# Altium schematic sheet BatteryMonitor.SchDoc
size A
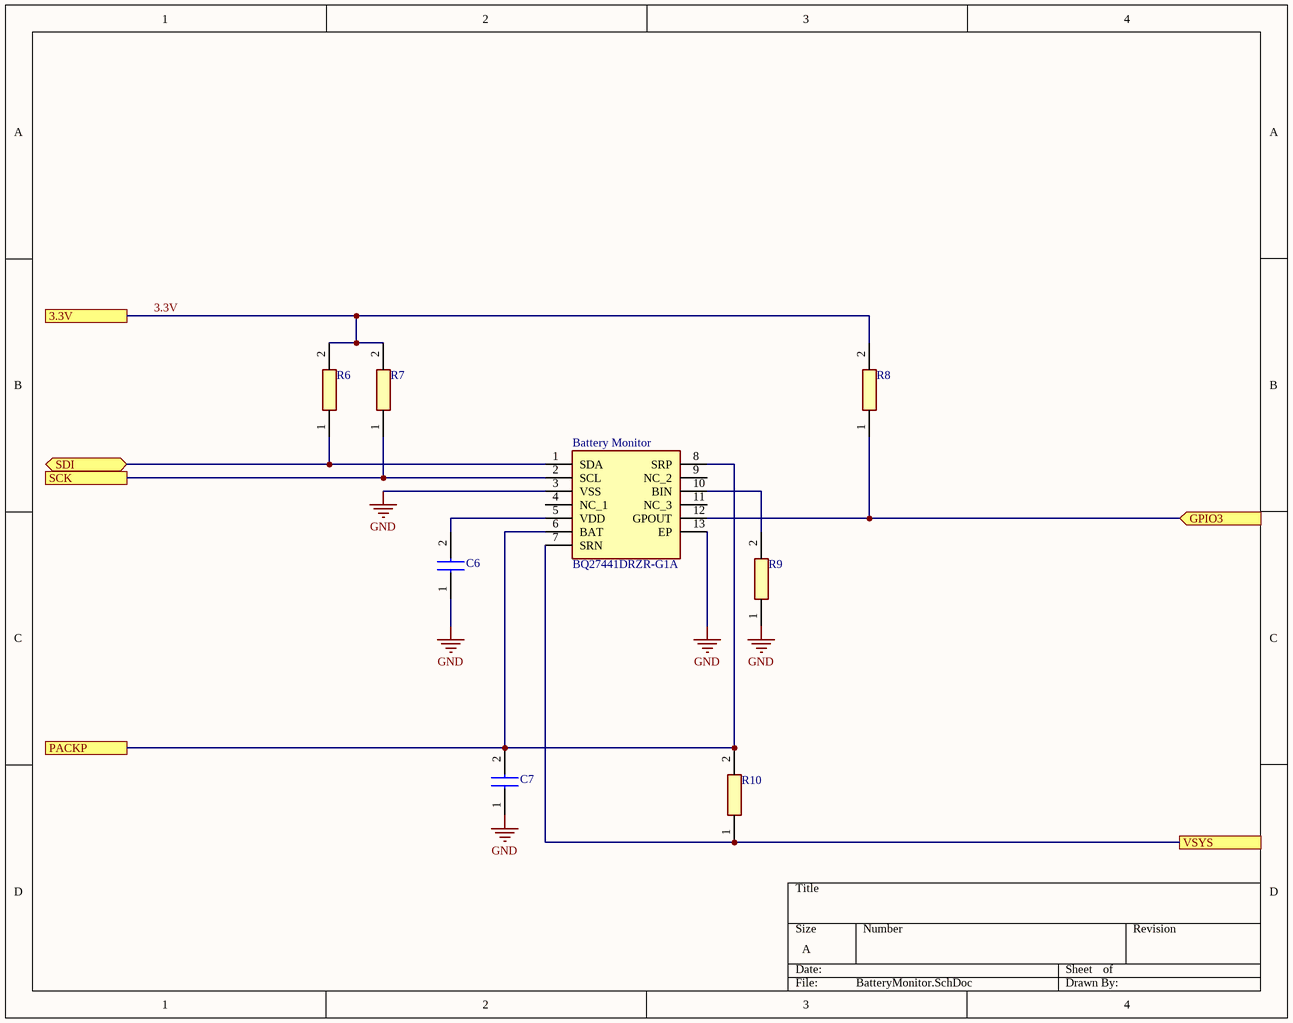
[diagram p0: BatteryMonitor.SchDoc]

## Parts
Battery_Monitor  BQ27441DRZR-G1A  [BQ27441DRZRG1A]
C6  C0603C150K5GAC  [CAPC1608X87N]  (value not drawn)
C7  C0603C150K5GAC  [CAPC1608X87N]  (value not drawn)
R6  CRCW06034K70JNEA  [RESC1608X50N]  (value not drawn)
R7  CRCW06034K70JNEA  [RESC1608X50N]  (value not drawn)
R8  CRCW06034K70JNEA  [RESC1608X50N]  (value not drawn)
R9  CRCW06034K70JNEA  [RESC1608X50N]  (value not drawn)
R10  CRCW06034K70JNEA  [RESC1608X50N]  (value not drawn)

## Ports
3.3V, GPIO3 (in), PACKP, SCK, SDI (bidir), VSYS

## Nets
GND: Battery_Monitor.3(VSS) Battery_Monitor.13(EP) C6.1 C7.1 R9.1
3.3V: R6.2 R7.2 R8.2 ; port 3.3V
GPIO3: Battery_Monitor.12(GPOUT) R8.1 ; port GPIO3
PACKP: Battery_Monitor.6(BAT) Battery_Monitor.8(SRP) C7.2 R10.2 ; port PACKP
SCK: Battery_Monitor.2(SCL) R7.1 ; port SCK
SDI: Battery_Monitor.1(SDA) R6.1 ; port SDI
VSYS: Battery_Monitor.7(SRN) R10.1 ; port VSYS
NetBattery_Monitor_5: Battery_Monitor.5(VDD) C6.2
NetBattery_Monitor_10: Battery_Monitor.10(BIN) R9.2

Not connected (* = marked no-connect by the designer): Battery_Monitor 4(NC_1) 9(NC_2) 11(NC_3)

## Library data of the parts
Battery_Monitor = BQ27441DRZR-G1A: Integrated Circuit; Manufacturer_Name: Texas Instruments; Datasheet Link: http://www.ti.com/lit/gpn/bq27441-g1; Mouser2 Part Number: 595-BQ27441DRZR-G1A; Mouser2 Price/Stock: https://www.mouser.com/Search/Refine.aspx?Keyword=595-BQ27441DRZR-G1A; Manufacturer_Part_Number: BQ27441DRZR-G1A
C6 C7 = C0603C150K5GAC: Capacitor; Manufacturer_Name: Kemet; Datasheet Link: https://content.kemet.com/datasheets/KEM_C1003_C0G_SMD.pdf; Height: 0.87mm; Manufacturer_Part_Number: C0603C150K5GAC; Mouser Part Number: 80-C0603C150K5GAC; Mouser Price/Stock: https://www.mouser.co.uk/ProductDetail/KEMET/C0603C150K5GAC?qs=Zjfhvh7dXTMDnIuVVWtUUQ%3D%3D
R6-R10 = CRCW06034K70JNEA: Resistor; Manufacturer_Name: Vishay; Datasheet Link: http://www.vishay.com/docs/20035/dcrcwe3.pdf; Height: 0.5mm; Manufacturer_Part_Number: CRCW06034K70JNEA; Arrow Part Number: CRCW06034K70JNEA; Arrow Price/Stock: https://www.arrow.com/en/products/crcw06034k70jnea/vishay; Mouser Part Number: 71-CRCW0603J-4.7K-E3; Mouser Price/Stock: https://www.mouser.co.uk/ProductDetail/Vishay-Dale/CRCW06034K70JNEA?qs=C0xaqriB68jbLUpBrIbing%3D%3D